# EAGLE design fc (EAGLE 9.2.2)

## Sheet 1 of 5: Atmega
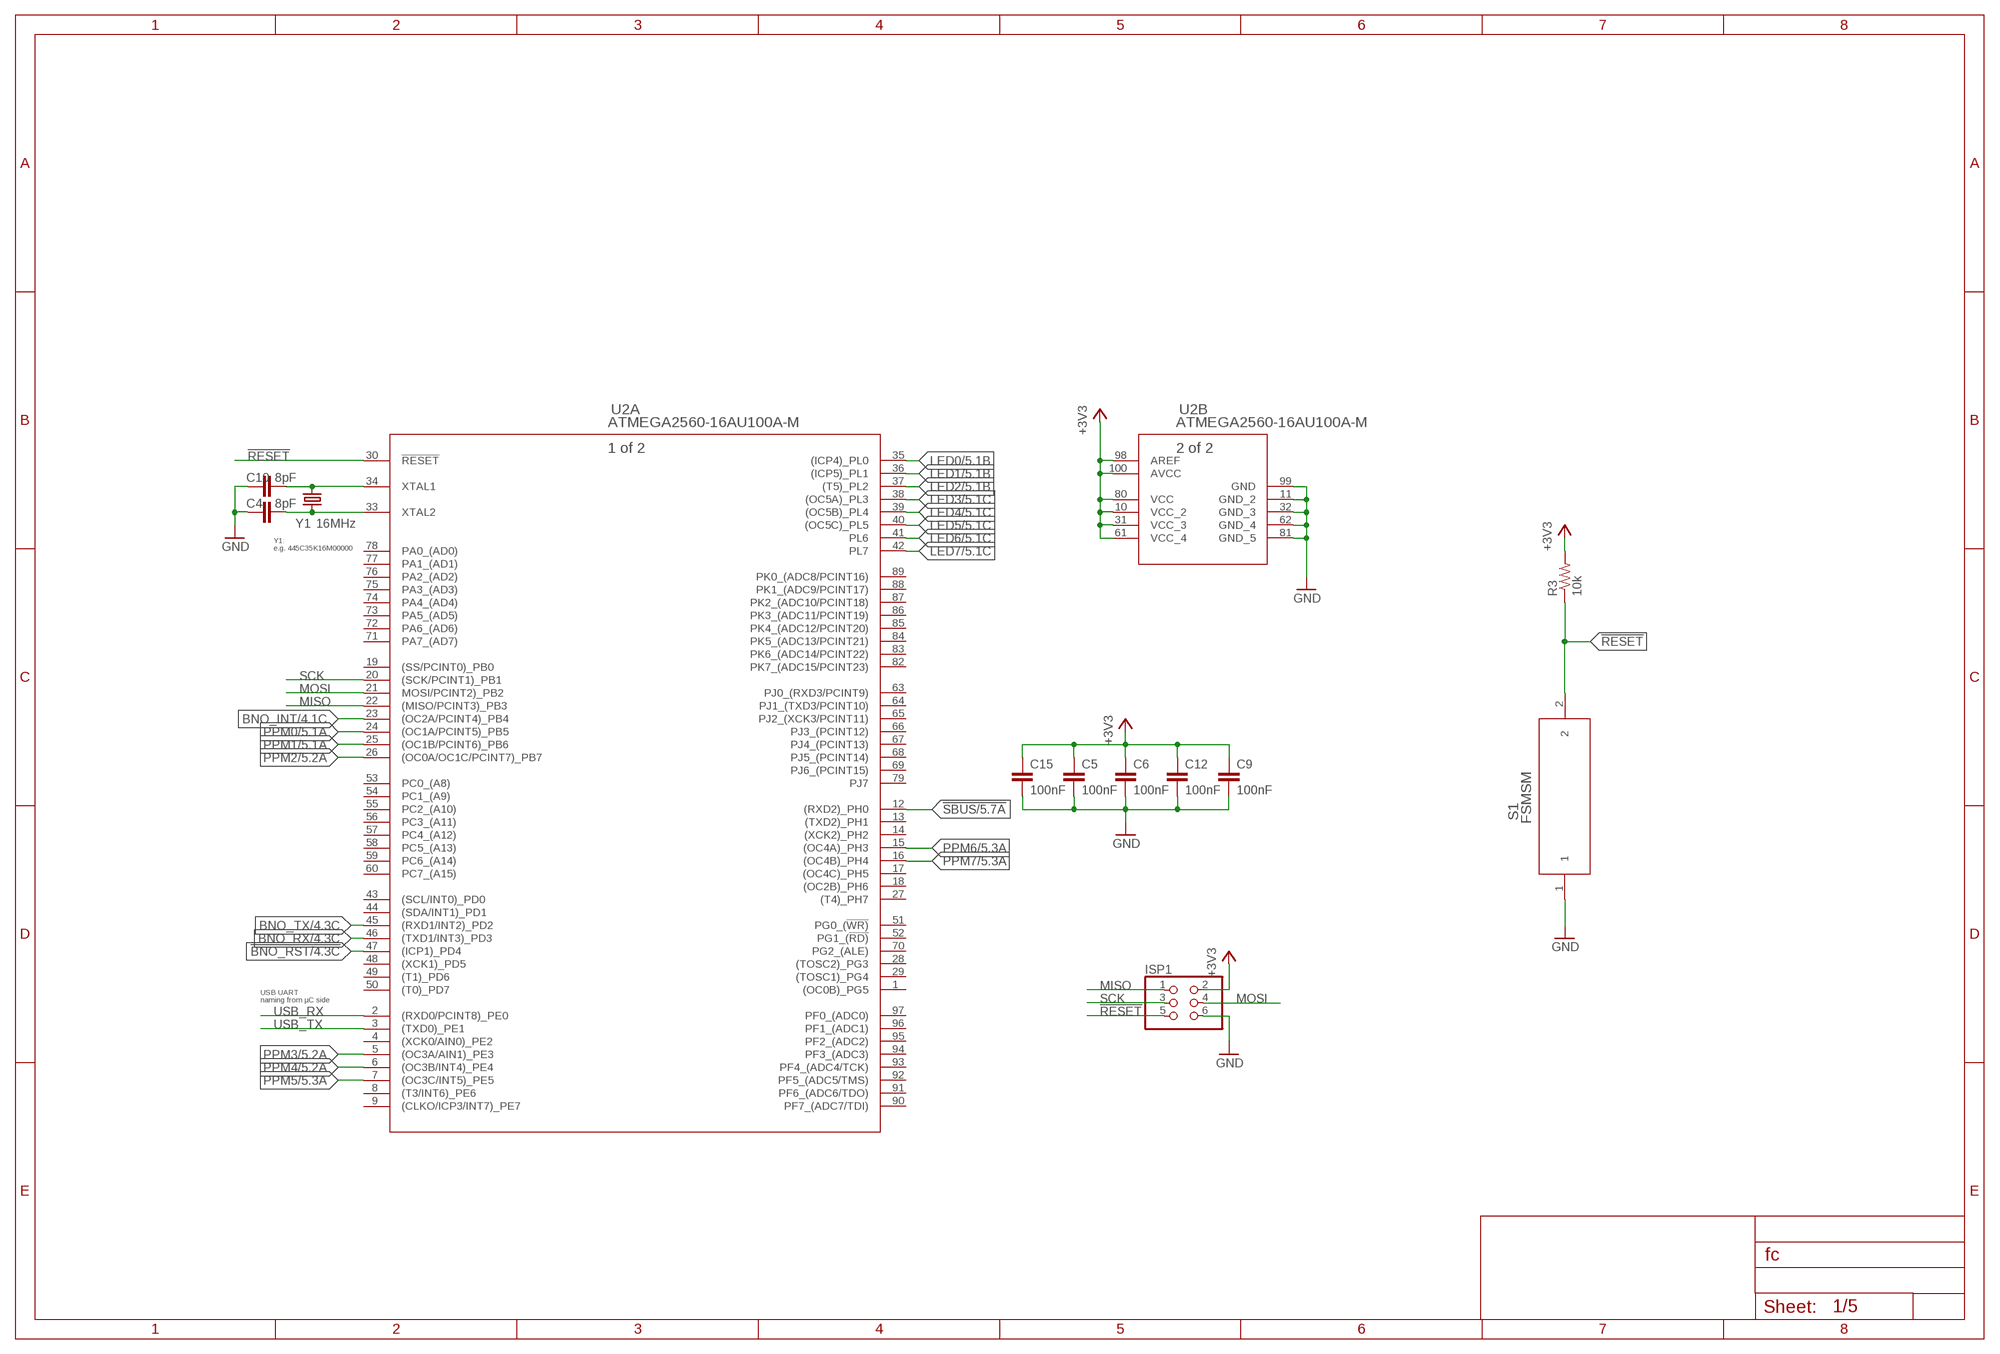
[diagram p0: schematic, sheet 1]

### Parts
C4  8pF  CAP_GENERIC0603  [0603]
C5  100nF  CAP_GENERIC0603  [0603]
C6  100nF  CAP_GENERIC0603  [0603]
C9  100nF  CAP_GENERIC0603  [0603]
C10  8pF  CAP_GENERIC0603  [0603]
C12  100nF  CAP_GENERIC0603  [0603]
C15  100nF  CAP_GENERIC0603  [0603]
ISP1  PINHD-2X3  [2X03]
R3  10k  RESISTOR0603  [0603]
S1  FSMSM  [SWITCH_FSMSM]
U2  ATMEGA2560-16AU100A-M  [100A-M]
Y1  16MHz  CRYSTALSMD-5X3.2-2PAD  [CRYSTAL-SMD-5X3.2-2PAD]

### Nets
!BNO_RST: U2.47(A:(ICP1)_PD4) ; also sheet 4
!RESET: ISP1.5 R3.1 S1.2 U2.30(A:!RESET)
!SBUS: U2.12(A:(RXD2)_PH0) ; also sheet 5
+3V3: C5.1 C6.1 C9.1 C12.1 C15.1 ISP1.2 R3.2 U2.10(B:VCC_2) U2.31(B:VCC_3) U2.61(B:VCC_4) U2.80(B:VCC) U2.98(B:AREF) U2.100(B:AVCC) ; also sheet 2,3,4,5
BNO_INT: U2.23(A:(OC2A/PCINT4)_PB4) ; also sheet 4
BNO_RX: U2.46(A:(TXD1/INT3)_PD3) ; also sheet 4
BNO_TX: U2.45(A:(RXD1/INT2)_PD2) ; also sheet 4
GND: C4.1 C5.2 C6.2 C9.2 C10.1 C12.2 C15.2 ISP1.6 S1.1 U2.11(B:GND_2) U2.32(B:GND_3) U2.62(B:GND_4) U2.81(B:GND_5) U2.99(B:GND) ; also sheet 2,3,4,5
LED0: U2.35(A:(ICP4)_PL0) ; also sheet 5
LED1: U2.36(A:(ICP5)_PL1) ; also sheet 5
LED2: U2.37(A:(T5)_PL2) ; also sheet 5
LED3: U2.38(A:(OC5A)_PL3) ; also sheet 5
LED4: U2.39(A:(OC5B)_PL4) ; also sheet 5
LED5: U2.40(A:(OC5C)_PL5) ; also sheet 5
LED6: U2.41(A:PL6) ; also sheet 5
LED7: U2.42(A:PL7) ; also sheet 5
MISO: ISP1.1 U2.22(A:(MISO/PCINT3)_PB3)
MOSI: ISP1.4 U2.21(A:MOSI/PCINT2)_PB2)
N$32: C10.2 U2.34(A:XTAL1) Y1.P$2
N$33: C4.2 U2.33(A:XTAL2) Y1.P$1
PPM0: U2.24(A:(OC1A/PCINT5)_PB5) ; also sheet 5
PPM1: U2.25(A:(OC1B/PCINT6)_PB6) ; also sheet 5
PPM2: U2.26(A:(OC0A/OC1C/PCINT7)_PB7) ; also sheet 5
PPM3: U2.5(A:(OC3A/AIN1)_PE3) ; also sheet 5
PPM4: U2.6(A:(OC3B/INT4)_PE4) ; also sheet 5
PPM5: U2.7(A:(OC3C/INT5)_PE5) ; also sheet 5
PPM6: U2.15(A:(OC4A)_PH3) ; also sheet 5
PPM7: U2.16(A:(OC4B)_PH4) ; also sheet 5
SCK: ISP1.3 U2.20(A:(SCK/PCINT1)_PB1)
USB_RX: U2.2(A:(RXD0/PCINT8)_PE0) ; also sheet 3
USB_TX: U2.3(A:(TXD0)_PE1) ; also sheet 3
Unconnected: U2.1(A:(OC0B)_PG5) U2.4(A:(XCK0/AIN0)_PE2) U2.8(A:(T3/INT6)_PE6) U2.9(A:(CLKO/ICP3/INT7)_PE7) U2.13(A:(TXD2)_PH1) U2.14(A:(XCK2)_PH2) U2.17(A:(OC4C)_PH5) U2.18(A:(OC2B)_PH6) U2.19(A:(SS/PCINT0)_PB0) U2.27(A:(T4)_PH7) U2.28(A:(TOSC2)_PG3) U2.29(A:(TOSC1)_PG4) U2.43(A:(SCL/INT0)_PD0) U2.44(A:(SDA/INT1)_PD1) U2.48(A:(XCK1)_PD5) U2.49(A:(T1)_PD6) U2.50(A:(T0)_PD7) U2.51(A:PG0_(!WR)) U2.52(A:PG1_(!RD)) U2.53(A:PC0_(A8)) U2.54(A:PC1_(A9)) U2.55(A:PC2_(A10)) U2.56(A:PC3_(A11)) U2.57(A:PC4_(A12)) U2.58(A:PC5_(A13)) U2.59(A:PC6_(A14)) U2.60(A:PC7_(A15)) U2.63(A:PJ0_(RXD3/PCINT9)) U2.64(A:PJ1_(TXD3/PCINT10)) U2.65(A:PJ2_(XCK3/PCINT11)) U2.66(A:PJ3_(PCINT12)) U2.67(A:PJ4_(PCINT13)) U2.68(A:PJ5_(PCINT14)) U2.69(A:PJ6_(PCINT15)) U2.70(A:PG2_(ALE)) U2.71(A:PA7_(AD7)) U2.72(A:PA6_(AD6)) U2.73(A:PA5_(AD5)) U2.74(A:PA4_(AD4)) U2.75(A:PA3_(AD3)) U2.76(A:PA2_(AD2)) U2.77(A:PA1_(AD1)) U2.78(A:PA0_(AD0)) U2.79(A:PJ7) U2.82(A:PK7_(ADC15/PCINT23)) U2.83(A:PK6_(ADC14/PCINT22)) U2.84(A:PK5_(ADC13/PCINT21)) U2.85(A:PK4_(ADC12/PCINT20)) U2.86(A:PK3_(ADC11/PCINT19)) U2.87(A:PK2_(ADC10/PCINT18)) U2.88(A:PK1_(ADC9/PCINT17)) U2.89(A:PK0_(ADC8/PCINT16)) U2.90(A:PF7_(ADC7/TDI)) U2.91(A:PF6_(ADC6/TDO)) U2.92(A:PF5_(ADC5/TMS)) U2.93(A:PF4_(ADC4/TCK)) U2.94(A:PF3_(ADC3)) U2.95(A:PF2_(ADC2)) U2.96(A:PF1_(ADC1)) U2.97(A:PF0_(ADC0))

### Notes on the sheet
- Y1:
  e.g. 445C35K16M00000
- USB UART
  naming from µC side

## Sheet 2 of 5: 5V-3V3 Regler
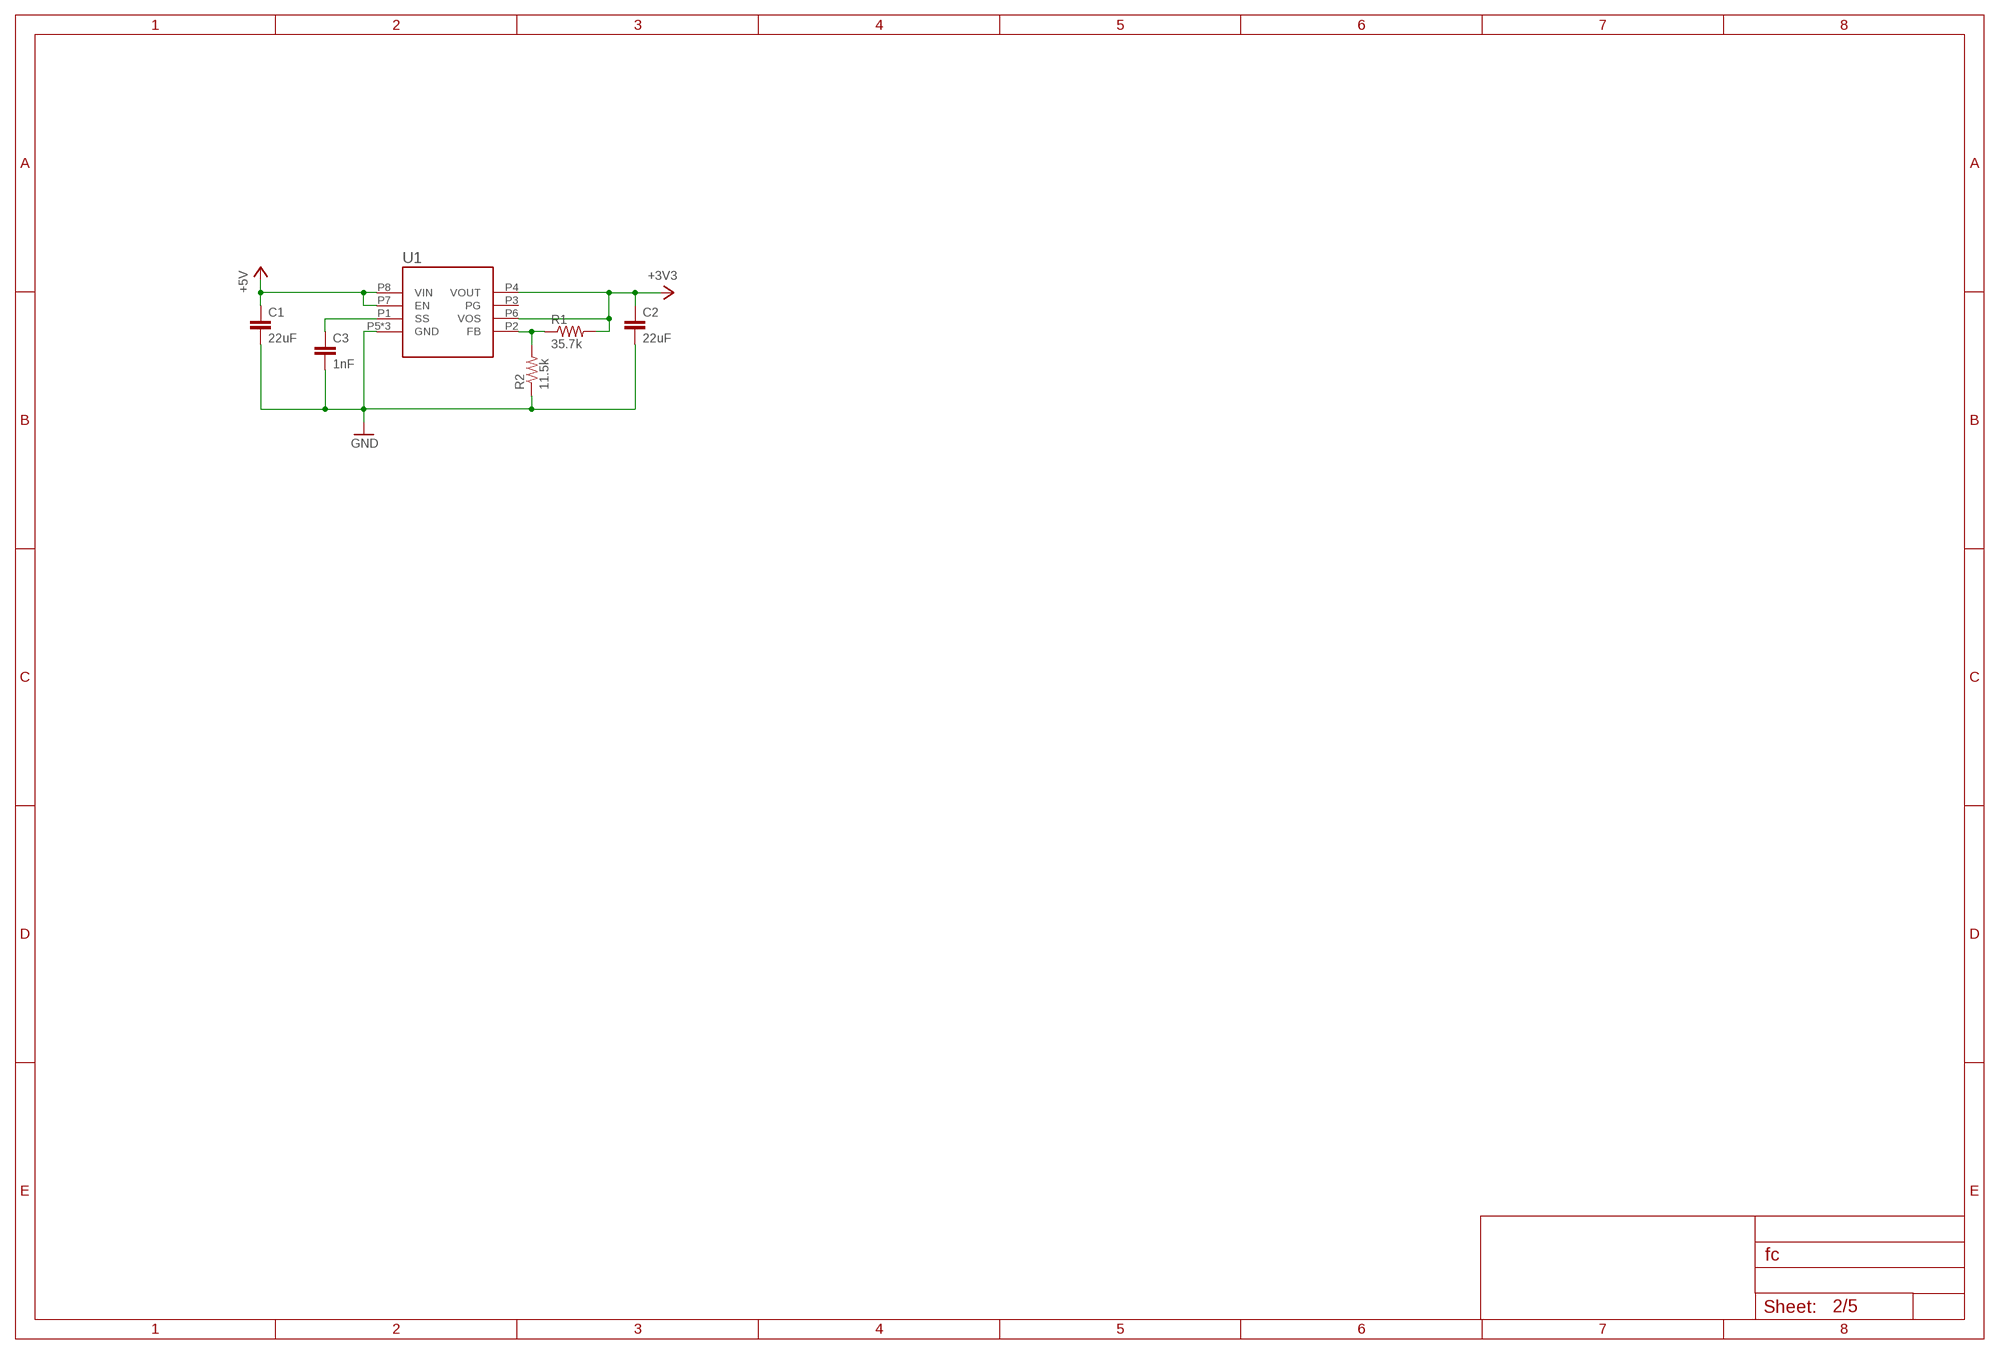
[diagram p1: schematic, sheet 2]

### Parts
C1  22uF  22UF-0805-6.3V-20%  [0805]
C2  22uF  22UF-0805-6.3V-20%  [0805]
C3  1nF  1.0NF/1000PF-0603-50V-10%  [0603]
R1  35.7k  RESISTOR0603  [0603]
R2  11.5k  RESISTOR0603  [0603]
U1  LMZ21700  [SIL0008E]

### Nets
+3V3: C2.1 R1.2 U1.P4(VOUT) U1.P6(VOS) ; also sheet 1,3,4,5
+5V: C1.1 U1.P7(EN) U1.P8(VIN) ; also sheet 5
GND: C1.2 C2.2 C3.2 R2.1 U1.P5(GND) U1.P9(GND) U1.P10(GND) ; also sheet 1,3,4,5
N$8: R1.1 R2.2 U1.P2(FB)
N$9: C3.1 U1.P1(SS)
Unconnected: U1.P3(PG)

## Sheet 3 of 5: USB-UART
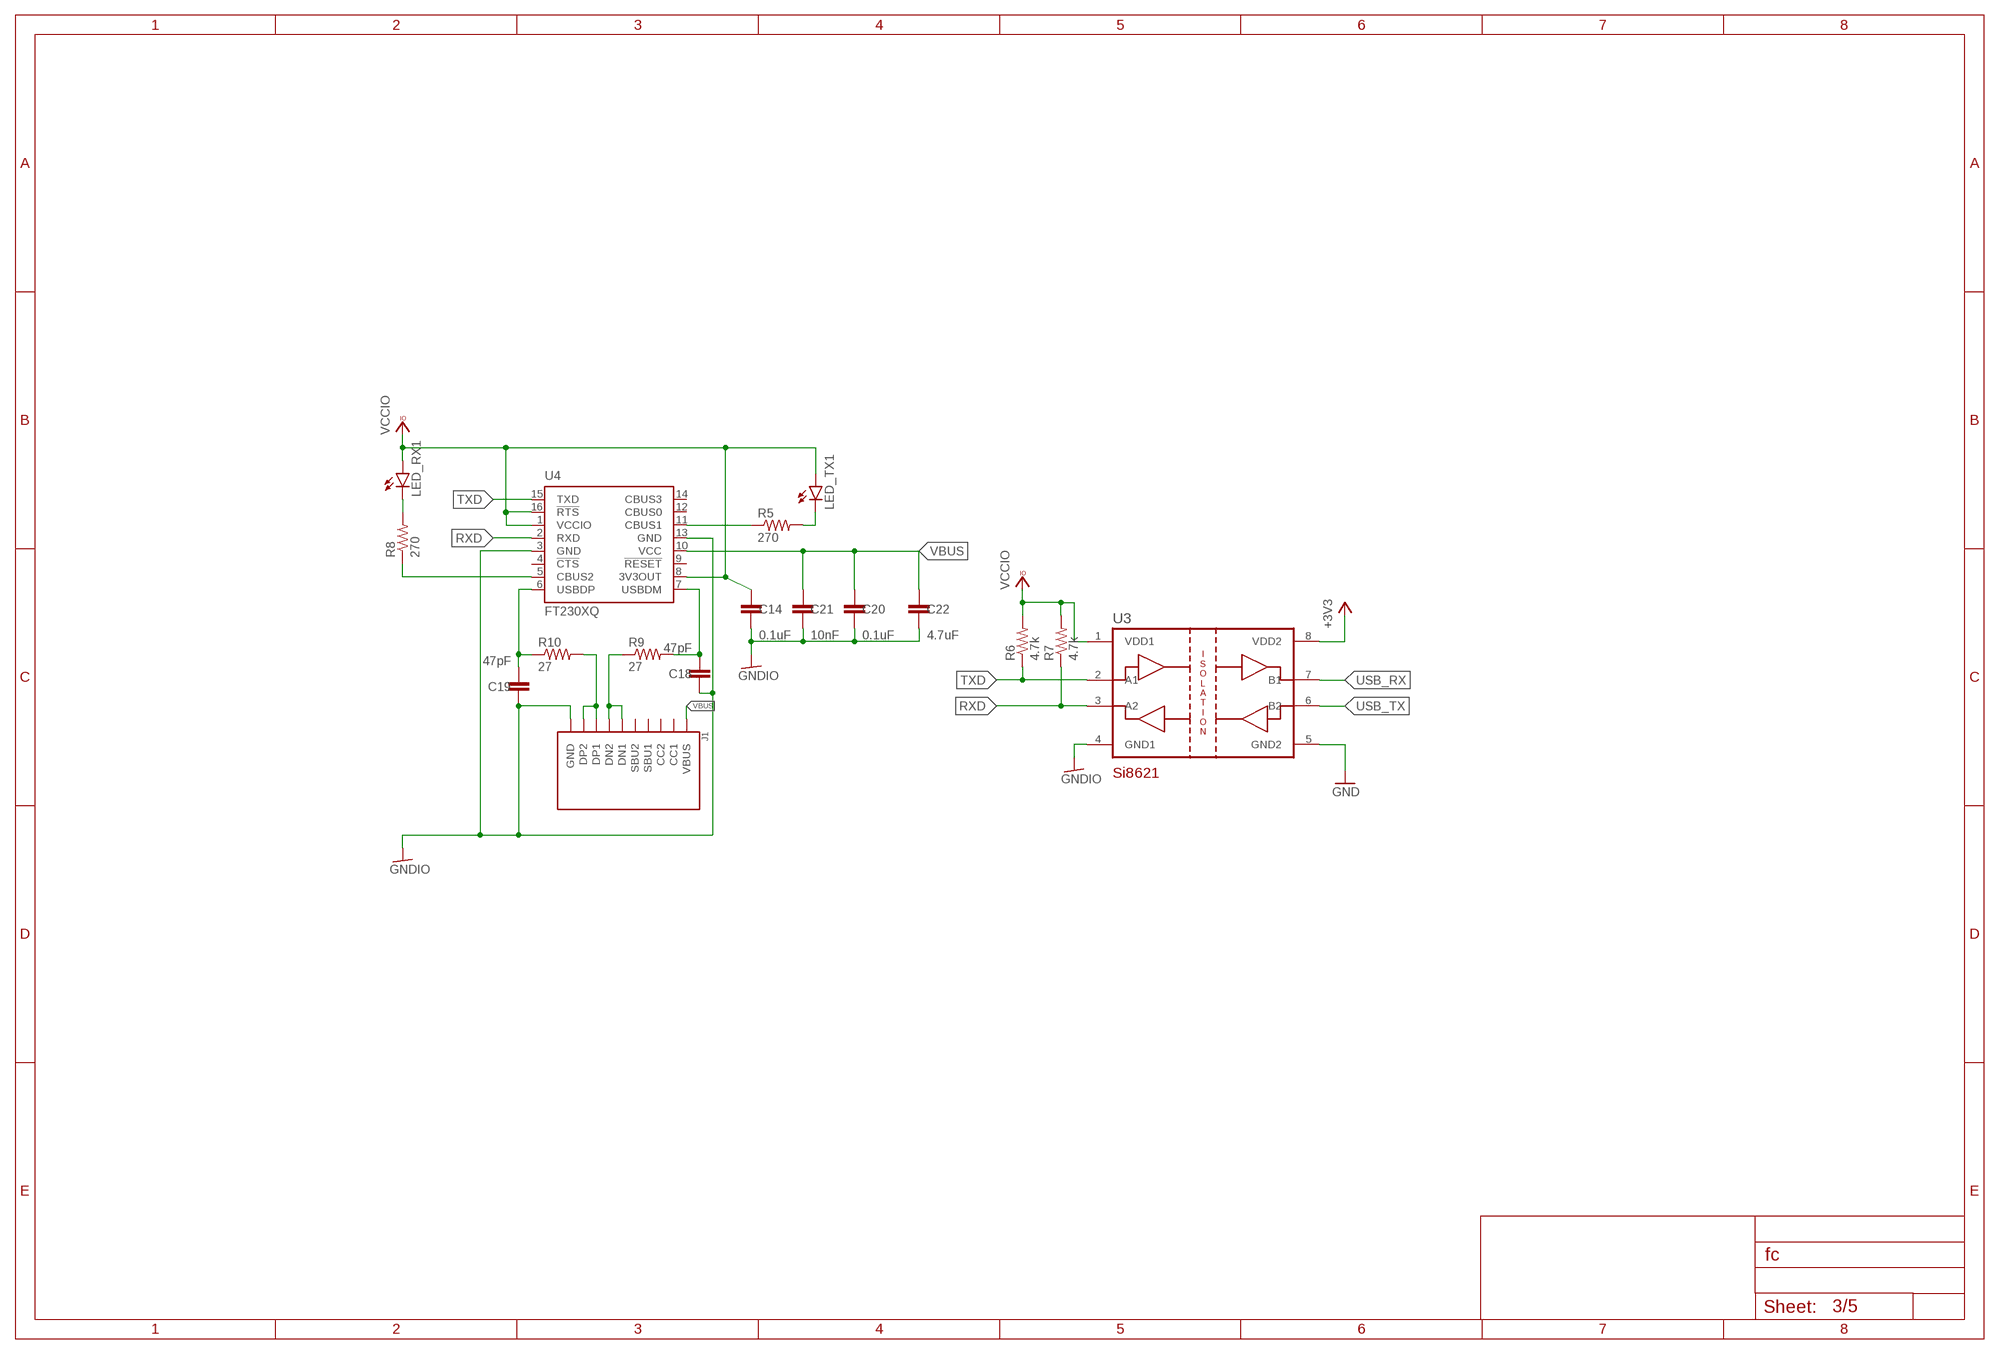
[diagram p2: schematic, sheet 3]

### Parts
C14  0.1uF  0.1UF-0603-25V-5%  [0603]
C18  47pF  47PF-0603-50V-5%  [0603]
C19  47pF  47PF-0603-50V-5%  [0603]
C20  0.1uF  0.1UF-0603-25V-5%  [0603]
C21  10nF  10NF-0603-50V-10%  [0603]
C22  4.7uF  4.7UF0603  [0603]
J1  USBC  [USBC]
LED_RX1  LED0603  [LED-0603]
LED_TX1  LED0603  [LED-0603]
R5  270  RESISTOR0603  [0603]
R6  4.7k  4.7KOHM-0603-1/10W-1%  [0603]
R7  4.7k  4.7KOHM-0603-1/10W-1%  [0603]
R8  270  RESISTOR0603  [0603]
R9  27  27OHM-0603-1/10W-1%  [0603]
R10  27  27OHM-0603-1/10W-1%  [0603]
U3  SI8621AB-B-IS  [SO08]
U4  FT230XQ  [QFN16]

### Nets
+3V3: U3.8(VDD2) ; also sheet 1,2,4,5
D+1: J1.A6(DP1) J1.B6(DP2) R10.2
D-1: J1.A7(DN1) J1.B7(DN2) R9.1
GND: U3.5(GND2) ; also sheet 1,2,4,5
GNDIO: C14.2 C18.1 C19.1 C20.2 C21.2 C22.2 J1.A1(GND) J1.A12(GND) J1.S1(GND) J1.S2(GND) J1.S3(GND) J1.S4(GND) U3.4(GND1) U4.3(GND) U4.13(GND)
N$2: R5.1 U4.11(CBUS1)
N$3: LED_RX1.C R8.2
N$4: LED_TX1.C R5.2
N$5: R8.1 U4.5(CBUS2)
RXD: R7.1 U3.3(A2) U4.2(RXD)
TXD: R6.1 U3.2(A1) U4.15(TXD)
USB_RX: U3.7(B1) ; also sheet 1
USB_TX: U3.6(B2) ; also sheet 1
USBDM1: C18.2 R9.2 U4.7(USBDM)
USBDP1: C19.2 R10.1 U4.6(USBDP)
VBUS: C20.1 C21.1 C22.1 J1.A4(VBUS) J1.A9(VBUS) U4.10(VCC)
VCCIO: C14.1 LED_RX1.A LED_TX1.A R6.2 R7.2 U3.1(VDD1) U4.1(VCCIO) U4.8(3V3OUT) U4.16(!RTS)
Unconnected: J1.A5(CC1) J1.A8(SBU1) J1.B5(CC2) J1.B8(SBU2) U4.4(!CTS) U4.9(!RESET) U4.12(CBUS0) U4.14(CBUS3)

## Sheet 4 of 5: BNO055
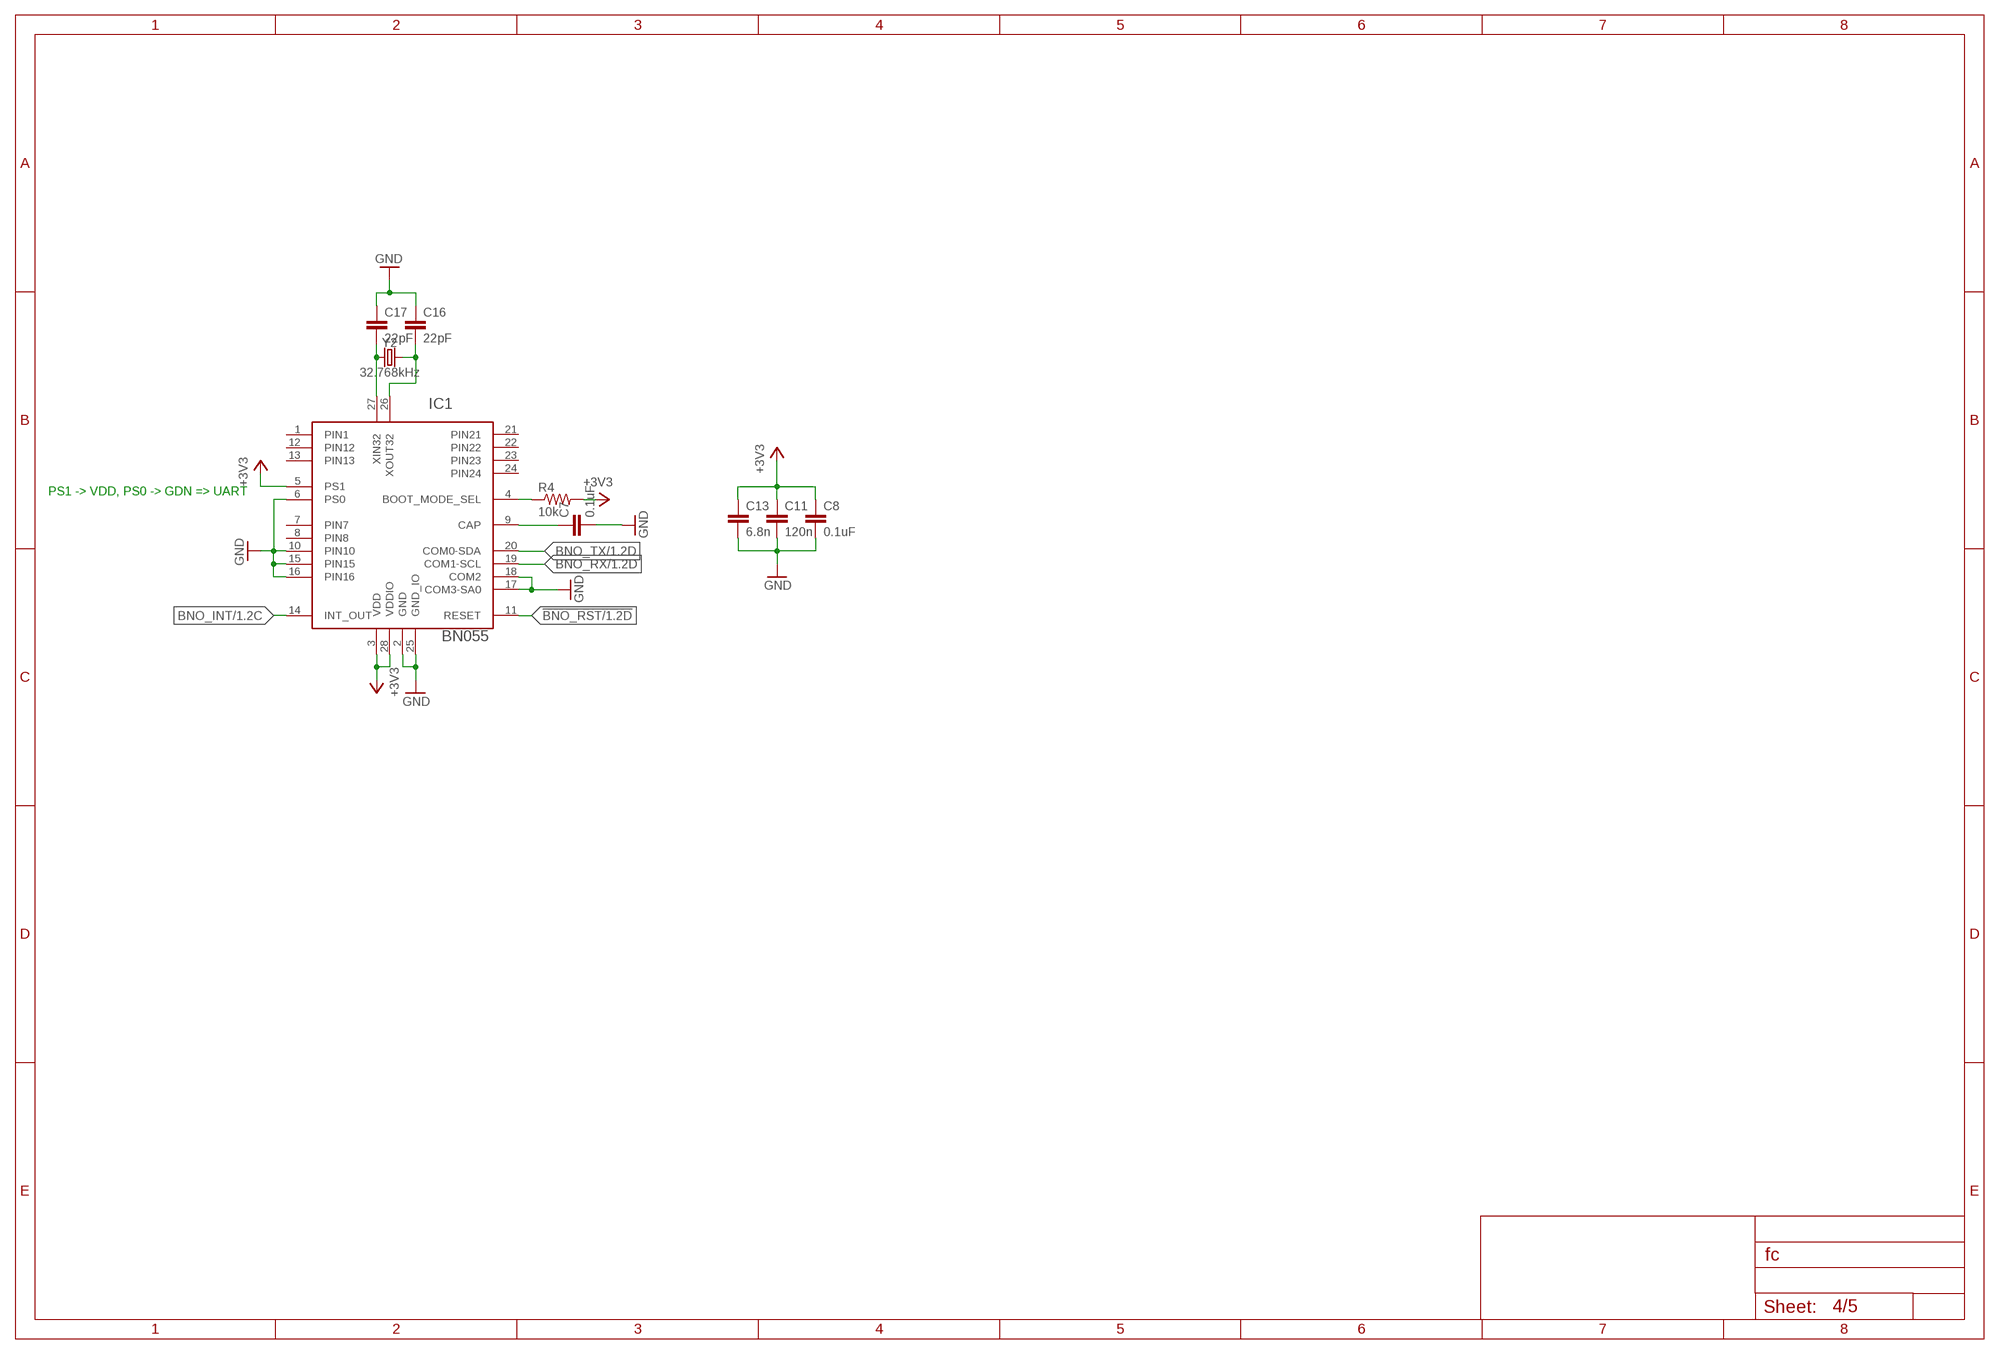
[diagram p3: schematic, sheet 4]

### Parts
C7  0.1uF  0.1UF-0603-25V-(+80/-20%)  [0603]
C8  0.1uF  0.1UF-0603-25V-(+80/-20%)  [0603]
C11  120n  CAP_GENERIC0603  [0603]
C13  6.8n  CAP_GENERIC0603  [0603]
C16  22pF  22PF-0603-50V-5%  [0603]
C17  22pF  22PF-0603-50V-5%  [0603]
IC1  BN055  1658_BNO055  [LGA-28_3.80X5.20/0.5]
R4  10k  RESISTOR0603  [0603]
Y2  32.768kHz  CRYSTAL-32.768KHZSMD-3.2X1.5  [CRYSTAL-SMD-3.2X1.5MM]

### Nets
!BNO_RST: IC1.11(RESET) ; also sheet 1
+3V3: C8.1 C11.1 C13.1 IC1.3(VDD) IC1.5(PS1) IC1.28(VDDIO) R4.2 ; also sheet 1,2,3,5
BNO_INT: IC1.14(INT_OUT) ; also sheet 1
BNO_RX: IC1.19(COM1-SCL) ; also sheet 1
BNO_TX: IC1.20(COM0-SDA) ; also sheet 1
GND: C7.2 C8.2 C11.2 C13.2 C16.1 C17.1 IC1.2(GND) IC1.6(PS0) IC1.10(PIN10) IC1.15(PIN15) IC1.16(PIN16) IC1.17(COM3-SA0) IC1.18(COM2) IC1.25(GND_IO) ; also sheet 1,2,3,5
N$1: IC1.4(BOOT_MODE_SEL) R4.1
N$12: C7.1 IC1.9(CAP)
N$13: C17.2 IC1.27(XIN32) Y2.P$1
N$25: C16.2 IC1.26(XOUT32) Y2.P$2
Unconnected: IC1.1(PIN1) IC1.7(PIN7) IC1.8(PIN8) IC1.12(PIN12) IC1.13(PIN13) IC1.21(PIN21) IC1.22(PIN22) IC1.23(PIN23) IC1.24(PIN24)

### Notes on the sheet
- PS1 -> VDD, PS0 -> GDN => UART

## Sheet 5 of 5: Connectors
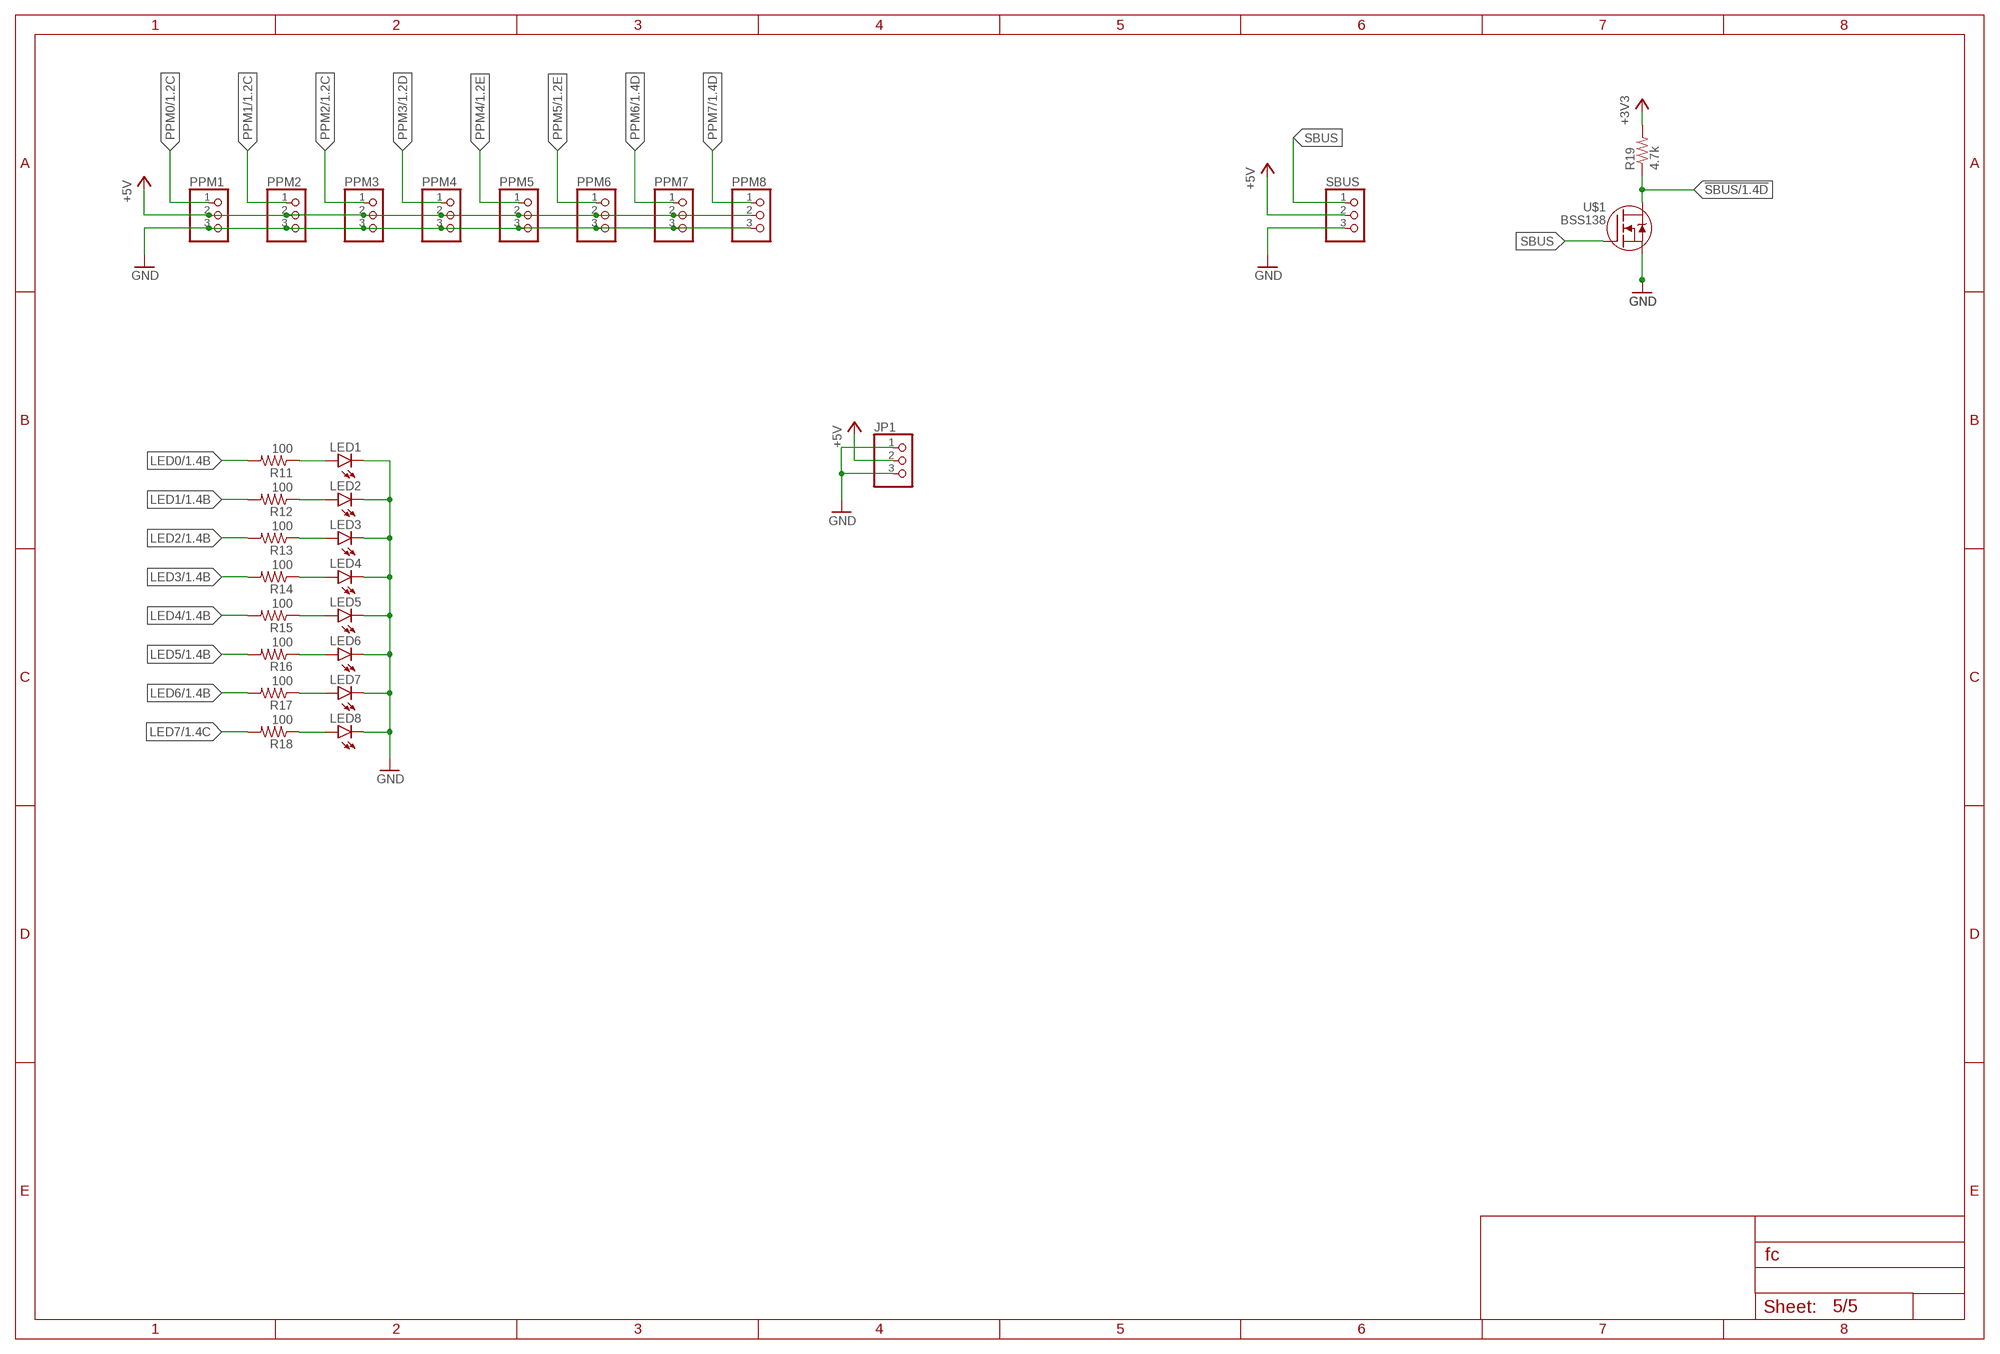
[diagram p4: schematic, sheet 5]

### Parts
JP1  PINHD-1X3  [1X03]
LED1  LED0603  [LED-0603]
LED2  LED0603  [LED-0603]
LED3  LED0603  [LED-0603]
LED4  LED0603  [LED-0603]
LED5  LED0603  [LED-0603]
LED6  LED0603  [LED-0603]
LED7  LED0603  [LED-0603]
LED8  LED0603  [LED-0603]
PPM1  PINHD-1X3  [1X03]
PPM2  PINHD-1X3  [1X03]
PPM3  PINHD-1X3  [1X03]
PPM4  PINHD-1X3  [1X03]
PPM5  PINHD-1X3  [1X03]
PPM6  PINHD-1X3  [1X03]
PPM7  PINHD-1X3  [1X03]
PPM8  PINHD-1X3  [1X03]
R11  100  RESISTOR0603  [0603]
R12  100  RESISTOR0603  [0603]
R13  100  RESISTOR0603  [0603]
R14  100  RESISTOR0603  [0603]
R15  100  RESISTOR0603  [0603]
R16  100  RESISTOR0603  [0603]
R17  100  RESISTOR0603  [0603]
R18  100  RESISTOR0603  [0603]
R19  4.7k  RESISTOR0603  [0603]
SBUS  PINHD-1X3  [1X03]
U$1  BSS138  [SOT23]

### Nets
!SBUS: R19.1 U$1.3(D) ; also sheet 1
+3V3: R19.2 ; also sheet 1,2,3,4
+5V: JP1.2 PPM1.2 PPM2.2 PPM3.2 PPM4.2 PPM5.2 PPM6.2 PPM7.2 PPM8.2 SBUS.2 ; also sheet 2
GND: JP1.1 JP1.3 LED1.C LED2.C LED3.C LED4.C LED5.C LED6.C LED7.C LED8.C PPM1.3 PPM2.3 PPM3.3 PPM4.3 PPM5.3 PPM6.3 PPM7.3 PPM8.3 SBUS.3 U$1.2(S) ; also sheet 1,2,3,4
LED0: R11.2 ; also sheet 1
LED1: R12.2 ; also sheet 1
LED2: R13.2 ; also sheet 1
LED3: R14.2 ; also sheet 1
LED4: R15.2 ; also sheet 1
LED5: R16.2 ; also sheet 1
LED6: R17.2 ; also sheet 1
LED7: R18.2 ; also sheet 1
N$15: LED2.A R12.1
N$18: LED3.A R13.1
N$20: LED4.A R14.1
N$22: LED5.A R15.1
N$24: LED6.A R16.1
N$27: LED7.A R17.1
N$29: LED8.A R18.1
N$31: LED1.A R11.1
PPM0: PPM1.1 ; also sheet 1
PPM1: PPM2.1 ; also sheet 1
PPM2: PPM3.1 ; also sheet 1
PPM3: PPM4.1 ; also sheet 1
PPM4: PPM5.1 ; also sheet 1
PPM5: PPM6.1 ; also sheet 1
PPM6: PPM7.1 ; also sheet 1
PPM7: PPM8.1 ; also sheet 1
SBUS: SBUS.1 U$1.1(G)

## Library data of the parts
C1 C2 = SparkFun-Capacitors:22UF: 22µF ceramic capacitors A capacitor is a passive two-terminal electrical component used to store electrical energy temporarily in an electric field.; PROD_ID: CAP-08402
C3 = SparkFun-Capacitors:1.0NF/1000PF: 1nF/1,000pF ceramic capacitors A capacitor is a passive two-terminal electrical component used to store electrical energy temporarily in an electric field.; PROD_ID: CAP-07886
C4-C6 C9-C13 C15 = sparkfun-generic-cap:CAP_GENERIC: generic ceramic capacitors A capacitor is a passive two-terminal electrical component used to store electrical energy temporarily in an electric field.
C7 C8 = SparkFun-Capacitors:0.1UF: 0.1µF ceramic capacitors A capacitor is a passive two-terminal electrical component used to store electrical energy temporarily in an electric field.; PROD_ID: CAP-00810
C14 C20 = SparkFun-Capacitors:0.1UF: 0.1µF ceramic capacitors A capacitor is a passive two-terminal electrical component used to store electrical energy temporarily in an electric field.; PROD_ID: CAP-08604
C16 C17 = SparkFun-Capacitors:22PF: 22pF ceramic capacitors A capacitor is a passive two-terminal electrical component used to store electrical energy temporarily in an electric field.; PROD_ID: CAP-07876
C18 C19 = SparkFun-Capacitors:47PF: 47pF ceramic capacitors A capacitor is a passive two-terminal electrical component used to store electrical energy temporarily in an electric field.; PROD_ID: CAP-08913
C21 = SparkFun-Capacitors:10NF: 0.01uF/10nF/10,000pF ceramic capacitors A capacitor is a passive two-terminal electrical component used to store electrical energy temporarily in an electric field. CAP-09321; PROD_ID: CAP-00867
C22 = SparkFun-Capacitors:4.7UF: 4.7µF ceramic capacitors A capacitor is a passive two-terminal electrical component used to store electrical energy temporarily in an electric field.; PROD_ID: CAP-08280
IC1 = BNO055:1658_BNO055: BN055 Intelligent 9-axis absolute orientation sensor; PART_NUMBER: BNO055
ISP1 = pinhead:PINHD-2X3: PIN HEADER
J1 = USBC:USBC
JP1 PPM1-PPM8 SBUS = pinhead:PINHD-1X3: PIN HEADER
LED1-LED8 LED_RX1 LED_TX1 = SparkFun-LED:LED: LED (Generic) Standard schematic elements and footprints for 5mm, 3mm, 1206, and 0603 sized LEDs. Generic LEDs with no color specified.
R1-R5 R8 R11-R19 = SparkFun-Resistors:RESISTOR: Generic Resistor Package
R6 R7 = SparkFun-Resistors:4.7KOHM: 4.7kΩ resistor A resistor is a passive two-terminal electrical component that implements electrical resistance as a circuit element. Resistors act to reduce current flow, and, at the same time, act to lower voltage levels within circuits. - Wikipedia; PROD_ID: RES-07857
R9 R10 = SparkFun-Resistors:27OHM: 27Ω resistor A resistor is a passive two-terminal electrical component that implements electrical resistance as a circuit element. Resistors act to reduce current flow, and, at the same time, act to lower voltage levels within circuits. - Wikipedia; PROD_ID: RES-09334
S1 = switch:FSMSM; MANUFACTURER_PART_NUMBER: FSMSM; VENDOR: TE Connectivity
U1 = jonas_ti:LMZ21700
U2 = ATMEGA2560:ATMEGA2560-16AU; MANUFACTURER_PART_NUMBER: ATMEGA256016AU; VENDOR: Atmel
U3 = SI8621AB-B-IS:SI8621AB-B-IS: None
U4 = ftdichip:FT230X: USB to BASIC UART IC Auto generated by make-symbol-device-package-bsdl.ulp Rev. 43 Source: Data sheet <http://www.ftdichip.com/Support/Documents/DataSheets/ICs/DS_FT230X.pdf>
U$1 = hwp_SS18:BSS138: Power MOSFET 200 mA, 50 V
Y1 = SparkFun-Clocks:CRYSTAL: Crystals (Generic) These are passive quartz crystals, which can be used as a clock source for a microcontroller. Crystal's are two-terminal devices. They require external "load" capacitors to generate an oscillating signal.
Y2 = SparkFun-Clocks:CRYSTAL-32.768KHZ: 32.768kHz Crystal Frequency: 32.768kHz Frequency Stability: ±20ppm Load Capacitance: 12.5pF (PTH-2X6 & SMD-3.2X1.5), 6pF (SMD-2X6) SparkFun Products: SparkFun BigTime Watch Kit <https://www.sparkfun.com/products/11734> SparkFun nRF52832 Breakout <https://www.sparkfun.com/products/13990> SparkFun Real Time Clock Module <https://www.sparkfun.com/products/12708>; PROD_ID: XTAL-13062

## Board
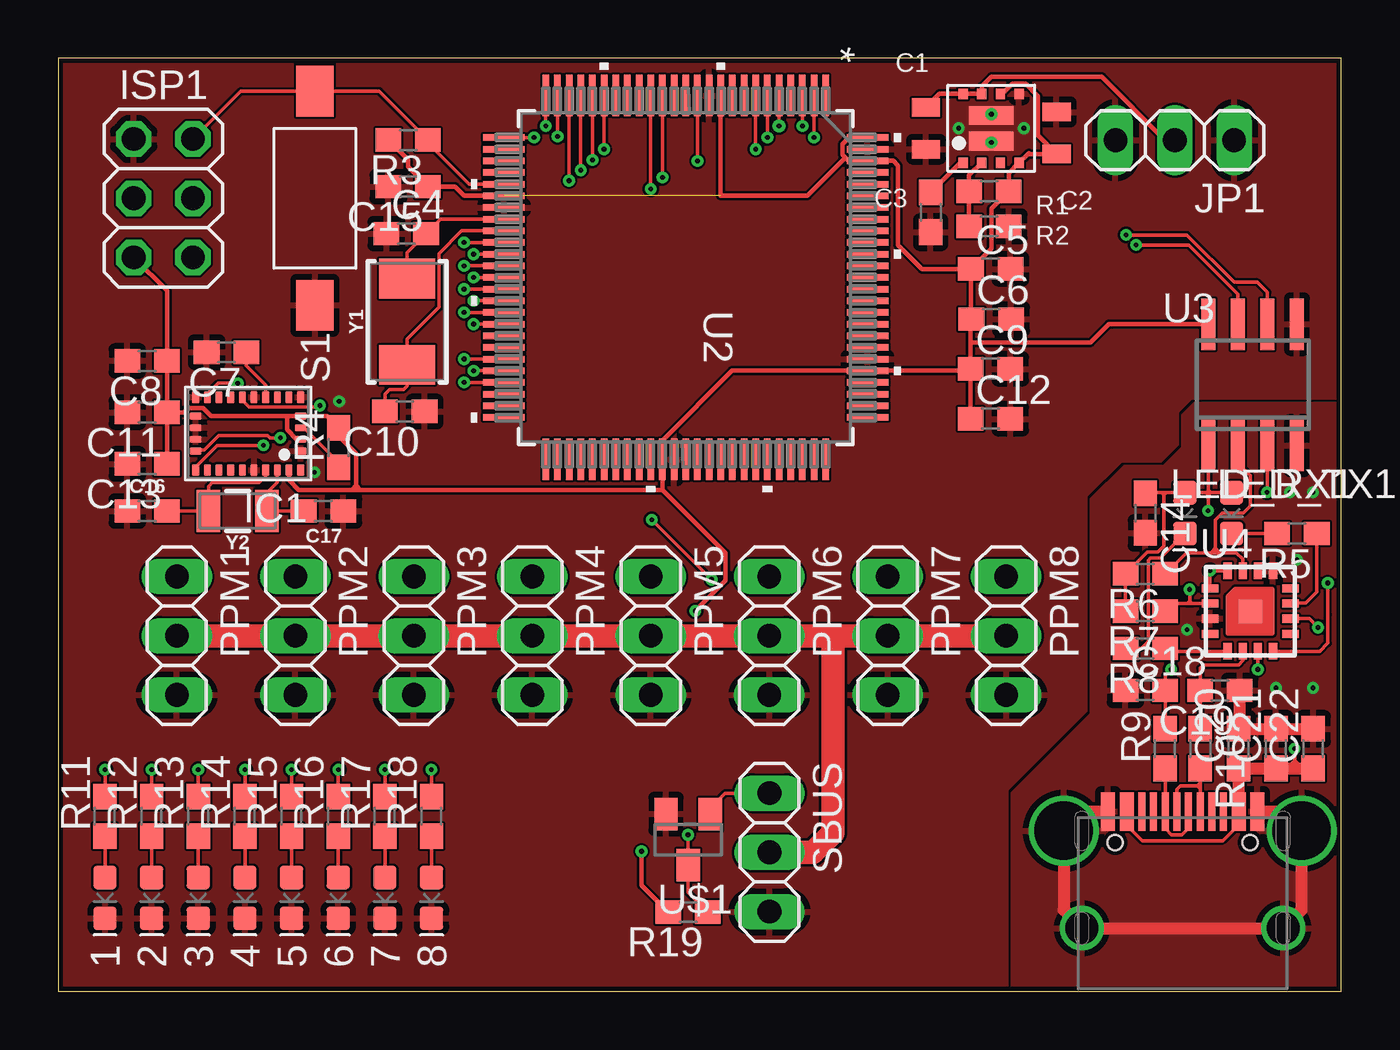
[diagram p5: board, top side]
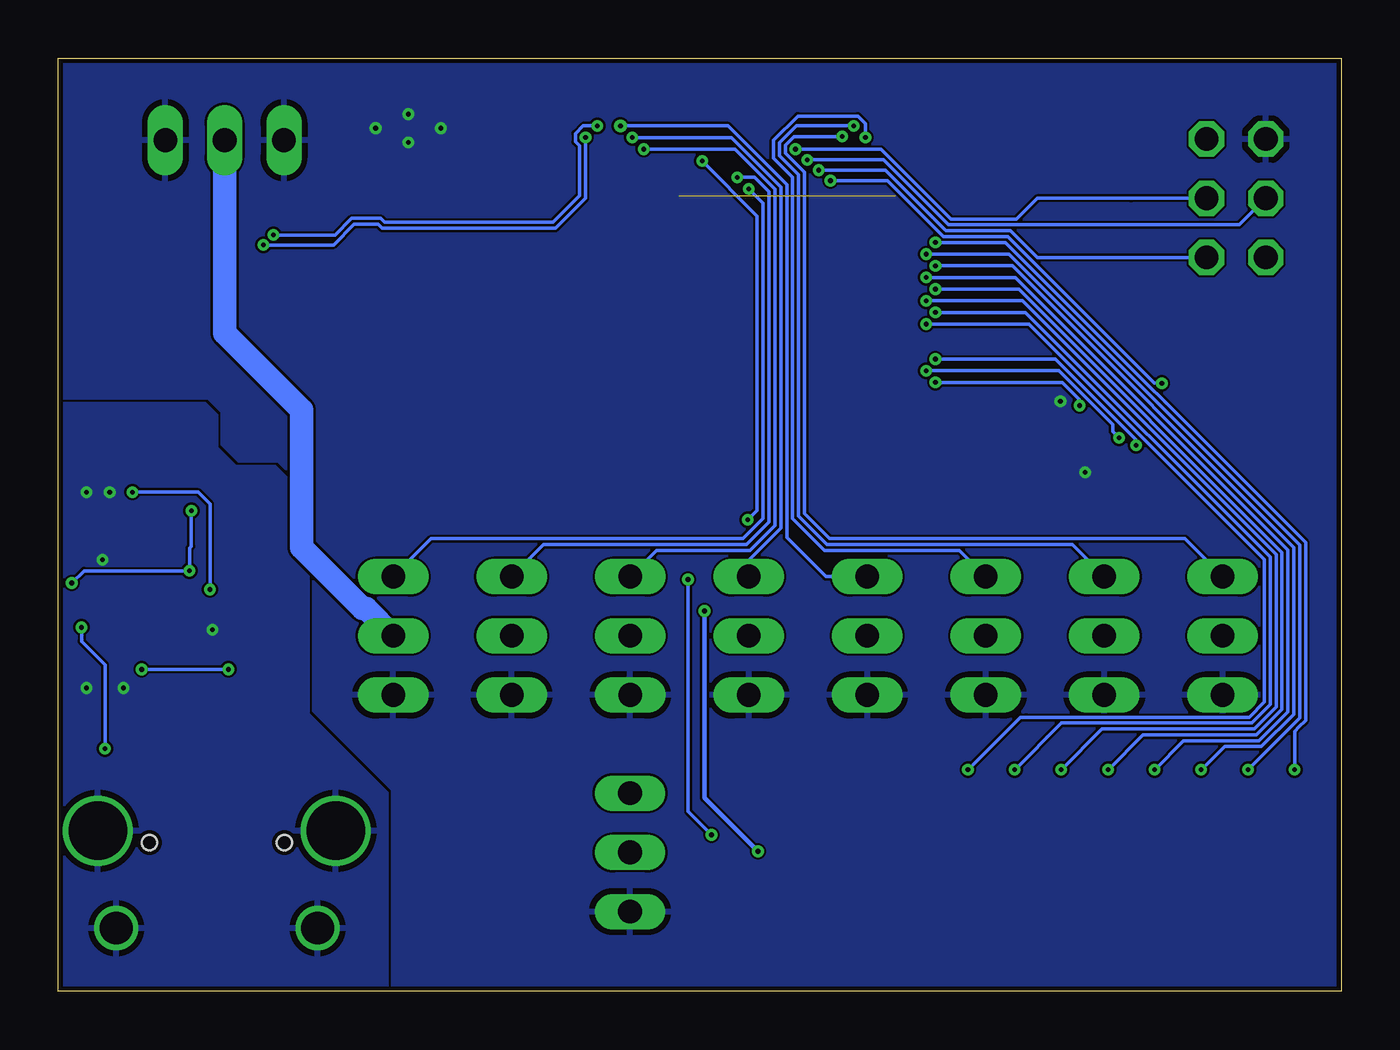
[diagram p6: board, bottom side, seen from below]

Size 55 x 40 mm. Coordinates in mm from the lower left corner, seen from the top.
Outline: 0,0 55,0 55,40 0,40 0,0
Copper layers (1*16): Top 0.035mm / dielectric 1.5mm / Bottom 0.035mm
Design rules "aisler_2_layer": minimum track width 0.1mm, minimum drill 0.2mm, track to track 0.1mm, track to pad 0.1mm, pad to pad 0.1mm, via to via 0.1mm, smd to smd 0.1mm, copper to edge 0.2mm, drill to drill 0.21mm, minimum pad ring 0.25mm, minimum via ring 0.15mm, stop-mask expansion 0mil, vias tented up to drill 0mil, thermal gap 10mil

### Footprints (pad centres in the part's own frame; a part is rotated, then mirrored left to right if it is on the bottom)
0805 = smd 0.8 x 1.2: 1 -0.9,0; 2 0.9,0
0603 = smd 1.1 x 1: 1 -0.85,0; 2 0.85,0
LGA-28_3.80X5.20/0.5 = smd 0.3 x 0.5: 1 -2.25,1.56; 6 -2.25,-1.56; 7 -1.75,-1.56; 8 -1.25,-1.56; 9 -0.75,-1.56; 10 -0.25,-1.56; 11 0.25,-1.56; 12 0.75,-1.56; 13 1.25,-1.56; 14 1.75,-1.56; 15 2.25,-1.56; 20 2.25,1.56; 21 1.75,1.56; 22 1.25,1.56; 23 0.75,1.56; 24 0.25,1.56; 25 -0.25,1.56; 26 -0.75,1.56; 27 -1.25,1.56; 28 -1.75,1.56 | smd 0.5 x 0.3: 2 -2.25,0.75; 3 -2.25,0.25; 4 -2.25,-0.25; 5 -2.25,-0.75; 16 2.25,-0.75; 17 2.25,-0.25; 18 2.25,0.25; 19 2.25,0.75
2X03 = drill 1.016 octagon: 1 -2.54,-1.27; 2 -2.54,1.27; 3 0,-1.27; 4 0,1.27; 5 2.54,-1.27; 6 2.54,1.27
USBC = smd 0.6 x 1.65: A1 -3.2,5.005; A4 -2.4,5.005; A9 2.4,5.005; A12 3.2,5.005 | smd 0.3 x 1.65: A5 -1.25,5.005; A6 -0.25,5.005; A7 0.25,5.005; A8 1.25,5.005; B5 1.75,5.005; B6 0.75,5.005; B7 -0.75,5.005; B8 -1.75,5.005 | drill 2.5 pad 2.9: S1 -5.1,4.18; S2 5.1,4.18 | drill 1.4 pad 1.8: S3 4.32,0; S4 -4.32,0 | hole 0.65: -2.89,3.68; 2.89,3.68
1X03 = drill 1.016 long: 1 -2.54,0; 2 0,0; 3 2.54,0
LED-0603 = smd 1 x 1: A -0.877,0; C 0.877,0
SWITCH_FSMSM = smd 2.18 x 1.6: 1 -4.59,0; 2 4.59,0
SIL0008E = smd 0.45 x 0.4: P1 -1.475,1.21; P2 -1.475,0.41; P3 -1.475,-0.39; P4 -1.475,-1.19; P5 1.475,-1.19; P6 1.475,-0.39; P7 1.475,0.41; P8 1.475,1.21 | smd 0.8 x 1.9: P9 -0.55,0; P10 0.55,0
100A-M = smd 1.778 x 0.279: 1 -7.798,6; 2 -7.798,5.5; 3 -7.798,5; 4 -7.798,4.5; 5 -7.798,4; 6 -7.798,3.5; 7 -7.798,3; 8 -7.798,2.5; 9 -7.798,2; 10 -7.798,1.5; 11 -7.798,1; 12 -7.798,0.5; 13 -7.798,0; 14 -7.798,-0.5; 15 -7.798,-1; 16 -7.798,-1.5; 17 -7.798,-2; 18 -7.798,-2.5; 19 -7.798,-3; 20 -7.798,-3.5; 21 -7.798,-4; 22 -7.798,-4.5; 23 -7.798,-5; 24 -7.798,-5.5; 25 -7.798,-6; 51 7.798,-6; 52 7.798,-5.5; 53 7.798,-5; 54 7.798,-4.5; 55 7.798,-4; 56 7.798,-3.5; 57 7.798,-3; 58 7.798,-2.5; 59 7.798,-2; 60 7.798,-1.5; 61 7.798,-1; 62 7.798,-0.5; 63 7.798,0; 64 7.798,0.5; 65 7.798,1; 66 7.798,1.5; 67 7.798,2; 68 7.798,2.5; 69 7.798,3; 70 7.798,3.5; 71 7.798,4; 72 7.798,4.5; 73 7.798,5; 74 7.798,5.5; 75 7.798,6 | smd 0.279 x 1.778: 26 -6,-7.798; 27 -5.5,-7.798; 28 -5,-7.798; 29 -4.5,-7.798; 30 -4,-7.798; 31 -3.5,-7.798; 32 -3,-7.798; 33 -2.5,-7.798; 34 -2,-7.798; 35 -1.5,-7.798; 36 -1,-7.798; 37 -0.5,-7.798; 38 0,-7.798; 39 0.5,-7.798; 40 1,-7.798; 41 1.5,-7.798; 42 2,-7.798; 43 2.5,-7.798; 44 3,-7.798; 45 3.5,-7.798; 46 4,-7.798; 47 4.5,-7.798; 48 5,-7.798; 49 5.5,-7.798; 50 6,-7.798; 76 6,7.798; 77 5.5,7.798; 78 5,7.798; 79 4.5,7.798; 80 4,7.798; 81 3.5,7.798; 82 3,7.798; 83 2.5,7.798; 84 2,7.798; 85 1.5,7.798; 86 1,7.798; 87 0.5,7.798; 88 0,7.798; 89 -0.5,7.798; 90 -1,7.798; 91 -1.5,7.798; 92 -2,7.798; 93 -2.5,7.798; 94 -3,7.798; 95 -3.5,7.798; 96 -4,7.798; 97 -4.5,7.798; 98 -5,7.798; 99 -5.5,7.798; 100 -6,7.798
SO08 = smd 0.6 x 2.2: 1 -1.905,-2.6; 2 -0.635,-2.6; 3 0.635,-2.6; 4 1.905,-2.6; 5 1.905,2.6; 6 0.635,2.6; 7 -0.635,2.6; 8 -1.905,2.6
QFN16 = smd 0.7 x 0.35: 1 -1.725,0.975; 2 -1.725,0.325; 3 -1.725,-0.325; 4 -1.725,-0.975; 9 1.725,-0.975; 10 1.725,-0.325; 11 1.725,0.325; 12 1.725,0.975 | smd 0.35 x 0.7: 5 -0.975,-1.725; 6 -0.325,-1.725; 7 0.325,-1.725; 8 0.975,-1.725; 13 0.975,1.725; 14 0.325,1.725; 15 -0.325,1.725; 16 -0.975,1.725 | smd 1 x 1: TAB 0,0
SOT23 = smd 1 x 1.4: 1 -0.95,-1.1; 2 0.95,-1.1; 3 0,1.1
CRYSTAL-SMD-5X3.2-2PAD = smd 1.7 x 2.4: P$1 1.85,0; P$2 -1.85,0
CRYSTAL-SMD-3.2X1.5MM = smd 1 x 1.8: P$1 -1.25,0; P$2 1.25,0

### Placement (x,y rotation side)
C1  37.2,37 270 top
C2  42.8,36.8 90 top
C3  37.4,33.4 270 top
C4  14.91,32.48 0 top
C5  39.97,30.97 0 top
C6  40,28.82 0 top
C7  7.21,27.4 180 top
C8  3.81,27.03 180 top
C9  39.96,26.68 0 top
C10  14.86,24.86 180 top
C11  3.81,24.82 180 top
C12  39.96,24.54 0 top
C13  3.81,22.61 180 top
C14  46.6,20.5 270 top
C15  15,34.5 180 top
C16  3.81,20.59 0 top
C17  11.37,20.59 180 top
C18  46.6,12.9 0 top
C19  49.8,12.9 180 top
C20  50.6,10.4 90 top
C21  52.2,10.4 90 top
C22  53.8,10.4 90 top
IC1  8.14,23.91 180 top
ISP1  4.5,34 90 top
J1  48.2,2.7 0 top
JP1  47.87,36.49 180 top
LED1  2,4 270 top
LED2  4,4 270 top
LED3  6,4 270 top
LED4  8,4 270 top
LED5  10,4 270 top
LED6  12,4 270 top
LED7  14,4 270 top
LED8  16,4 270 top
LED_RX1  48.3,20.5 270 top
LED_TX1  50.3,20.5 270 top
PPM1  5.08,15.24 270 top
PPM2  10.16,15.24 270 top
PPM3  15.24,15.24 270 top
PPM4  20.32,15.24 270 top
PPM5  25.4,15.24 270 top
PPM6  30.48,15.24 270 top
PPM7  35.56,15.24 270 top
PPM8  40.64,15.24 270 top
R1  39.9,34.3 0 top
R2  39.9,32.8 180 top
R3  15,36.5 180 top
R4  12.02,23.31 90 top
R5  53.1,19.62 180 top
R6  46.6,17.9 180 top
R7  46.6,16.3 180 top
R8  46.6,14.7 180 top
R9  47.45,10.4 90 top
R10  48.95,10.4 270 top
R11  2,7.5 90 top
R12  4,7.5 90 top
R13  6,7.5 90 top
R14  8,7.5 90 top
R15  10,7.5 90 top
R16  12,7.5 90 top
R17  14,7.5 90 top
R18  16,7.5 90 top
R19  27,3.4 180 top
S1  11,34 90 top
SBUS  30.49,5.95 270 top
U1  40,37 90 top
U2  26.9,30.6 270 top
U3  51.2,26 0 top
U4  51.1,16.3 0 top
U$1  27,6.5 180 top
Y1  14.95,28.7 90 top
Y2  7.69,20.59 180 top

### Tracks (layer width: path | path; a pad name or v marks a point on that pad's centre or on a via)
!BNO_RST  (via drill 0.2)
  Top 0.152: IC1.11 7.89,25.34 8.19,25.04 11.15,25.04 v11.21,25.11 | U2.47 v17.4,26.1
  Bottom 0.152: v11.21,25.11 11.21,25.36 11.96,26.1 v17.4,26.1
!RESET
  Top 0.152: ISP1.5 7.82,38.59 S1.2 13.76,38.59 R3.1 15.85,36.35 17.6,34.6 U2.30
!SBUS  (via drill 0.2)
  Top 0.152: U2.12 v27.4,35.6 | v25.45,20.21 v28,17.66 | v27,6.7 U$1.3 27,4.5 27,4.25 R19.1
  Bottom 0.152: v25.45,20.21 25.04,20.62 25.04,33.24 v27.4,35.6 | v27,6.7 28,7.7 v28,17.66
+3V3  (via drill 0.2)  (1 unrouted)
  Top 0.203: C11.1 C13.1 | C11.1 5.38,24.82 5.57,25.01 6.21,25.01 6.34,24.88 6.34,24.87 6.55,24.66 9.8,24.66 | 9.8,24.66 IC1.5 11.52,24.66 R4.2 12.02,23.8 12.77,23.04 12.77,21.67 | 9.8,24.66 9.8,24.08 10.22,23.66 IC1.3 | C12.1 39.06,24.49 39.06,24.4 39.11,24.45 C9.1 | C9.1 39.11,27.8 | 39.11,27.8 39.11,28.79 C6.1 39.12,28.85 C5.1 | 39.11,27.8 44.25,27.8 45.05,28.6 U3.8 | C9.1 38.8,26.68 38.72,26.6 U2.80 28.88,26.6 25.9,23.62 U2.61 25.9,21.5 | 33.75,35.73 33.88,35.6 U2.98 35.8,35.6 36,35.4 36,32 37.03,30.97 C5.1 | 33.75,35.73 33.61,35.88 33.61,36.32 33.88,36.6 U2.100 | 33.75,35.73 32.12,34.1 28.4,34.1 U2.10 | ISP1.2 4.66,30.03 C8.1 C11.1 | C5.1 40,31.85 40,33.55 R1.2 40.75,35.09 U1.P4 41.56,35.9 | 41.56,35.9 C2.1 42,36.7 42,38.38 41.47,38.9 40.91,38.9 40.48,38.48 U1.P6 | 41.6,35.94 41.56,35.9 | R19.2 25,4.55 v25,6 | v27.3,16.3 28.6,17.6 28.6,18.8 25.9,21.5 | U2.31 17.4,34.1 17,34.5 C15.1 15,35.35 15,35.65 R3.2 | 25.9,21.5 13,21.5 12.94,21.5 | 12.94,21.5 12.6,21.5 | 12.6,21.5 10.3,21.5 9.89,21.91 IC1.28 | 12.77,21.67 12.6,21.5 | 12.77,21.67 12.94,21.5
  Bottom 0.203: v27.3,16.3 27.3,8.3 v25,6
+5V
  Top 0.203: JP1.2 47.44,36.49 44.73,39.2 40.01,39.2 39.6,38.8 U1.P7 U1.P8 37.77,38.48 C1.1
  Top 0.508: PPM1.2 PPM2.2 PPM3.2 PPM4.2 PPM5.2 PPM6.2
  Top 1.016: PPM8.2 PPM7.2 33.2,15.24 | 33.2,15.24 PPM6.2 PPM1.2 | 33.2,15.24 33.2,6.8 32.35,5.95 SBUS.2
  Bottom 1.016: PPM8.2 41.81,16.41 41.96,16.41 44.57,19.02 44.57,24.92 47.87,28.22 JP1.2
BNO_INT  (via drill 0.2)
  Top 0.152: v7.69,26.07 6.86,26.07 6.39,25.6 IC1.14 | v21.9,34.75 U2.23
  Bottom 0.152: v7.69,26.07 8,26.07 14.28,32.35 17.05,32.35 19.45,34.75 v21.9,34.75
BNO_RX  (via drill 0.2)
  Top 0.152: IC1.19 5.93,23.2 6.25,23.2 6.88,23.83 8.97,23.83 9.08,23.73 v9.52,23.73 | U2.46 v17.8,26.6
  Bottom 0.152: v9.52,23.73 9.79,24 9.79,24.29 12.1,26.6 v17.8,26.6
BNO_TX  (via drill 0.2)
  Top 0.152: IC1.20 5.89,22.48 6.81,23.41 v8.79,23.41 | U2.45 v17.4,27.1
  Bottom 0.152: v8.79,23.41 8.79,23.65 12.24,27.1 v17.4,27.1
D+1
  Top 0.152: J1.B6 48.95,8.68 | 48.95,8.68 48.95,8.8 | 48.95,8.8 48.95,8.93 | 48.95,8.93 R10.2 | J1.A6 47.95,8.65 48.1,8.8 48.83,8.8 | 48.83,8.8 48.95,8.8 | 48.83,8.8 48.95,8.68 | 48.83,8.8 48.95,8.93
D-1
  Top 0.152: J1.A7 48.45,6.98 48.17,6.7 47.73,6.7 47.48,6.95 47.48,7.68 J1.B7 R9.1
GND  (via drill 0.2)
  other vias: 10.97,22.25 12.04,25.3 38.6,37 41.4,37 40,36.4 40,37.6
  pour Top (rank 6): -2,42 -2,-2 57,-2 57,42
  pour Bottom (rank 6): -1.5,41.5 -1.5,-1.5 56.5,-1.5 56.5,41.5
GNDIO  (via drill 0.2)
  Top 0.508: C20.2 C21.2 C22.2 | 50.65,11.3 C19.1 | J1.A12 52.48,7.71 J1.S2 53.3,3.48 J1.S3 J1.S4 43.1,3.48 J1.S1 43.92,7.71 J1.A1
  other vias: 52.8,21.4 53.8,21.4 53.1,18.5 52.2,13 53.8,13 48.4,15.5
  pour Top: 55,0 40.9,0 40.9,8.5 44.3,11.9 44.3,21.1 45.7,22.5 47.4,22.5 48.2,23.3 48.2,24.7 48.7,25.2 49.9,25.2 55,25.2
  pour Bottom: 55,0 40.9,0 40.9,8.5 44.3,11.9 44.3,21.1 45.7,22.5 47.4,22.5 48.2,23.3 48.2,24.7 48.7,25.2 49.9,25.2 55,25.2
LED0  (via drill 0.2)
  Top 0.152: U2.35 v17.4,32.1 | R11.2 v2,9.5
  Bottom 0.152: v17.4,32.1 14.39,32.1 1.53,19.24 1.53,11.62 1.82,11.32 2,11.14 v2,9.5
LED1  (via drill 0.2)
  Top 0.152: v17.8,31.6 U2.36 | R12.2 v4,9.5
  Bottom 0.152: v17.8,31.6 14.25,31.6 1.78,19.13 1.78,12 1.78,11.77 1.78,11.72 v4,9.5
LED2  (via drill 0.2)
  Top 0.152: U2.37 v17.4,31.1 | R13.2 v6,9.5
  Bottom 0.152: v17.4,31.1 14.1,31.1 2.03,19.03 2.03,11.88 3.42,10.49 5,10.49 5.99,9.5 v6,9.5
LED3  (via drill 0.2)
  Top 0.152: v17.8,30.6 U2.38 | R14.2 v8,9.5
  Bottom 0.152: v17.8,30.6 13.96,30.6 2.28,18.93 2.28,11.98 3.52,10.74 6,10.74 6.76,10.74 v8,9.5
LED4  (via drill 0.2)
  Top 0.152: U2.39 v17.4,30.1 | R15.2 v10,9.5
  Bottom 0.152: v17.4,30.1 13.82,30.1 2.54,18.82 2.54,12.09 3.63,10.99 8.5,10.99 v9.99,9.5 v10,9.5
LED5  (via drill 0.2)
  Top 0.152: v17.8,29.6 U2.40 | R16.2 v12,9.5
  Bottom 0.152: v17.8,29.6 13.67,29.6 2.79,18.71 2.79,12.19 3.73,11.24 10,11.24 10.26,11.24 v12,9.5
LED6  (via drill 0.2)
  Top 0.152: U2.41 v17.4,29.1 | R17.2 v14,9.5
  Bottom 0.152: v17.4,29.1 13.53,29.1 3.04,18.61 3.04,12.29 3.84,11.5 12,11.5 v14,9.5
LED7  (via drill 0.2)
  Top 0.152: U2.42 v17.8,28.6 | R18.2 v16,9.5
  Bottom 0.152: v17.8,28.6 13.39,28.6 3.29,18.51 3.29,12.4 3.94,11.75 13.5,11.75 13.75,11.75 v16,9.5
MISO  (via drill 0.2)
  Top 0.152: U2.22 v22.4,35.2
  Bottom 0.152: ISP1.1 13.04,31.46 14.18,32.6 16.95,32.6 19.54,35.2 v22.4,35.2
MOSI  (via drill 0.2)
  Top 0.152: U2.21 v22.9,35.65
  Bottom 0.152: ISP1.4 4.37,32.86 16.84,32.86 19.63,35.65 v22.9,35.65
N$1
  Top 0.152: IC1.4 10.52,24.16 12.02,22.66 R4.1
N$2
  Top 0.152: U4.11 52.85,16.65 53.47,16.65 53.95,17.13 R5.1
N$3
  Top 0.152: LED_RX1.C 47.25,18.58 46.83,18.58 46.72,18.47 46.72,15 46.42,14.7 R8.2
N$4
  Top 0.152: LED_TX1.C R5.2
N$5
  Top 0.152: R8.1 47.58,14.57 U4.5
N$8
  Top 0.203: U1.P2 39.05,34.98 R1.1 R2.2
N$9
  Top 0.203: C3.1 38.67,35.52 U1.P1
N$12
  Top 0.152: IC1.9 8.89,26 8.06,26.83 C7.1
N$13
  Top 0.152: IC1.27 9.39,21.81 8.98,21.4 8.94,21.4 Y2.P$1 C17.2
N$15
  Top 0.152: R12.1 LED2.A
N$18
  Top 0.152: LED3.A R13.1
N$20
  Top 0.152: LED4.A R14.1
N$22
  Top 0.152: LED5.A R15.1
N$24
  Top 0.152: R16.1 LED6.A
N$25
  Top 0.152: IC1.26 8.89,22.07 8.62,21.8 6.6,21.8 6.44,21.64 Y2.P$2 C16.2
N$27
  Top 0.152: R17.1 LED7.A
N$29
  Top 0.152: R18.1 LED8.A
N$31
  Top 0.152: R11.1 LED1.A
N$32
  Top 0.152: U2.34 17.3,32.6 16.33,31.63 16.33,29.33 14.95,27.95 Y1.P$2 14.95,25.95 14.8,25.8 14.21,25.8 14.01,25.6 C10.2
N$33
  Top 0.152: Y1.P$1 14.95,31.67 C4.2 16.38,33.1 U2.33
PPM0  (via drill 0.2)
  Top 0.152: U2.24 v21.4,36.65
  Bottom 0.152: PPM1.1 6.7,19.4 21.94,19.4 23.01,20.48 23.01,35.11 23.83,35.92 23.83,36.28 23.45,36.65 v21.4,36.65
PPM1  (via drill 0.2)
  Top 0.152: U2.25 v20.9,37.1
  Bottom 0.152: PPM2.1 11.53,19.15 22.04,19.15 23.27,20.37 23.27,35.01 24.08,35.82 24.08,36.38 23.36,37.1 v20.9,37.1
PPM2  (via drill 0.2)
  Top 0.152: U2.26 v20.4,36.6
  Bottom 0.152: PPM3.1 16.36,18.9 22.15,18.9 23.52,20.27 23.52,34.9 24.33,35.71 24.33,36.49 23.29,37.53 20.72,37.53 20.4,37.2 v20.4,36.6
PPM3  (via drill 0.2 pad 0.55)
  Top 0.152: U2.5 v30.9,37.1
  Bottom 0.152: PPM4.1 22.1,17.78 23.77,19.45 23.77,34.59 26.28,37.1 v30.9,37.1
PPM4  (via drill 0.2)
  Top 0.152: U2.6 v30.4,36.6
  Bottom 0.152: PPM5.1 25.4,18.49 24.03,19.86 24.03,20.42 24.02,20.43 24.02,34.48 25.77,36.23 26.03,36.49 26.14,36.6 v30.4,36.6
PPM5  (via drill 0.2)
  Top 0.152: U2.7 v29.9,36.1
  Bottom 0.152: PPM6.1 29.36,18.9 25.35,18.9 24.28,19.97 24.28,25.45 24.27,25.46 24.27,34.38 25.99,36.1 v29.9,36.1
PPM6  (via drill 0.2)
  Top 0.152: U2.15 v25.9,34.9
  Bottom 0.152: PPM7.1 34.19,19.15 25.5,19.15 24.53,20.12 24.53,32.47 24.53,34.28 25.15,34.9 v25.9,34.9
PPM7  (via drill 0.2)
  Top 0.152: U2.16 v25.4,34.4
  Bottom 0.152: PPM8.1 39.02,19.4 25.65,19.4 24.78,20.27 24.78,33.78 v25.4,34.4
RXD  (via drill 0.2)
  Top 0.152: U3.3 51.83,23.39 v51.83,21.4 | U4.2 48.6,16.62 | 48.6,16.62 48.4,16.62 | 48.4,16.62 47.77,16.62 R7.1 | 48.5,16.73 48.6,16.62 | v48.5,17.23 48.5,16.73 | 48.5,16.73 48.4,16.62
  Bottom 0.152: v48.5,17.23 48.5,20.9 49,21.4 v51.83,21.4
SBUS
  Top 0.152: SBUS.1 28.59,8.49 27.95,7.85 U$1.1
SCK  (via drill 0.2)
  Top 0.152: U2.20 v23.4,36.1
  Bottom 0.152: ISP1.3 9,34 13.03,34 13.92,33.11 16.74,33.11 19.73,36.1 v23.4,36.1
TXD
  Top 0.152: U3.2 50.56,22.64 51.1,22.1 51.1,20.8 50.8,20.5 49.9,20.5 49.6,20.2 49.6,19 | R6.1 48.35,18.8 49.4,18.8 | 49.4,18.8 49.6,18.8 | 49.6,18.8 49.8,18.8 | 49.8,18.8 50.5,18.8 50.77,18.52 U4.15 | 49.8,18.8 49.6,19 | 49.6,19 49.4,18.8 | 49.6,19 49.6,18.8
USB_RX  (via drill 0.2)
  Top 0.152: U3.7 50.56,29.89 48.46,32 v46.2,32 | U2.2 v32.4,36.6
  Bottom 0.152: v46.2,32 43.2,32 42.31,32.89 41.29,32.89 41.11,32.71 33.69,32.71 32.4,34 v32.4,36.6
USB_TX  (via drill 0.2)
  Top 0.152: v45.78,32.43 48.39,32.43 50.41,30.4 51.4,30.4 51.84,29.96 U3.6 | U2.3 v31.9,37.1
  Bottom 0.152: v45.78,32.43 43.13,32.43 42.42,33.14 41.18,33.14 41.01,32.97 33.79,32.97 32.65,34.1 32.65,36.25 32.83,36.42 32.83,36.78 32.5,37.1 v31.9,37.1
USBDM1  (via drill 0.2)
  Top 0.152: R9.2 C18.2 47.45,13.55 v47.7,13.8 | U4.7 v51.42,13.8
  Bottom 0.152: v47.7,13.8 51,13.8 v51.42,13.8
USBDP1
  Top 0.152: R10.1 C19.2 48.95,13.85 49.1,14 50.6,14 50.77,14.18 U4.6
VBUS  (via drill 0.2)
  Top 0.152: J1.A9 50.6,7.13 49.92,6.45 46.48,6.45 45.8,7.13 J1.A4 | v53,10.4 53,9.9 | 53,9.9 53,9.55 | 53,9.9 52.65,9.55 52.6,9.55 | 53,9.9 53.3,9.6 53.3,9.55 | U4.10 53.62,15.97 v54,15.6
  Top 0.508: C22.1 53.3,9.55 53,9.55 52.6,9.55 C21.1 C20.1 J1.A9
  Bottom 0.152: v53,10.4 53,14 54,15 v54,15.6
VCCIO  (via drill 0.2)
  Top 0.152: U4.8 54.08,14.57 54.43,14.93 54.43,16.15 54.42,16.15 v54.42,17.5 | U4.16 v49.38,18.02 U4.1 | R7.2 R6.2 46.68,18.83 47.15,18.83 47.4,19.08 47.4,21.28 | 49.2,21.38 LED_RX1.A 47.5,21.38 | 49.2,21.38 49.3,21.38 | 49.3,21.38 49.4,21.38 | 49.4,21.38 LED_TX1.A | U3.1 49.3,21.48 | 49.3,21.47 49.3,21.38 | 49.3,21.38 | 49.3,21.48 49.4,21.38 | 49.3,21.48 49.3,21.47 | 49.3,21.47 49.2,21.38 | v49.3,20.6 v49.3,20.61 49.3,21.28 | 49.3,21.28 49.3,21.38 | 49.2,21.38 49.3,21.28 | 49.4,21.38 49.3,21.28 | 47.5,21.38 47.4,21.38 | 47.4,21.38 47.3,21.38 | 47.3,21.38 46.63,21.38 C14.1 | 47.4,21.38 47.4,21.28 | 47.4,21.28 47.3,21.38 | 47.4,21.28 47.5,21.38
  Bottom 0.152: v54.42,17.5 53.9,18.02 v49.38,18.02 49.38,19 49.3,19.07 v49.3,20.6

### Text on the board
tPlace: 1 | 1 | 2 | 3 | 4 | 5 | 6 | 7 | 8